# Altium schematic sheet 二极管.schdoc
size 52 x 35 mm
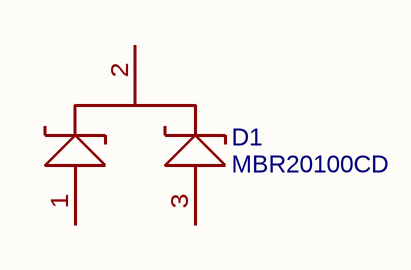
[diagram p0: 二极管.schdoc]

## Parts
D1  MBR20100CD  [TO-252AB_L6.5-W6.0-P4.50-LS11.6-BR]

## Nets

Not connected (* = marked no-connect by the designer): D1 1(A1) 2(C) 3(A2)

## Library data of the parts
D1 = MBR20100CD: BOM_Manufacturer: AnBon; Contributor: LCSC; BOM_Supplier: LCSC; BOM_Supplier Part: C397636; BOM_Manufacturer Part: MBR20100CD; spicePre: D; spiceSymbolName: MBR20100CD